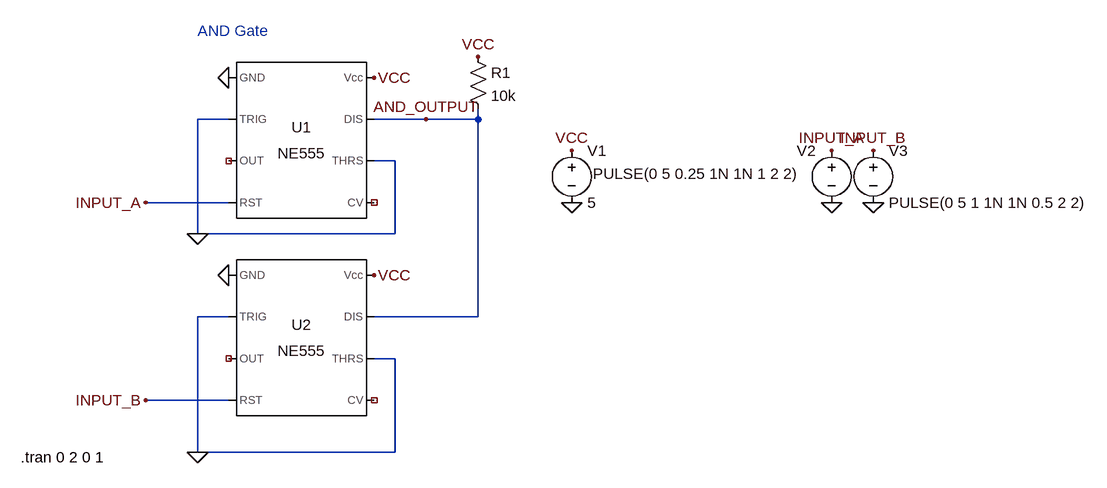
[diagram p0: schematic 555_AND_Gate.asc]
555_AND_Gate.asc, the LTspice schematic file:
Version 4
SHEET 1 1352 680
WIRE 32 48 -16 48
WIRE 336 48 256 48
WIRE 416 48 416 32
WIRE 416 48 336 48
WIRE 288 112 256 112
WIRE 32 176 -96 176
WIRE -16 224 -16 48
WIRE 288 224 288 112
WIRE 288 224 -16 224
WIRE 32 352 -16 352
WIRE 416 352 416 48
WIRE 416 352 256 352
WIRE 288 416 256 416
WIRE 32 480 -96 480
WIRE -16 560 -16 352
WIRE 288 560 288 416
WIRE 288 560 -16 560
FLAG 560 176 0
FLAG 560 96 VCC
FLAG 32 -16 0
FLAG 256 -16 VCC
FLAG 32 288 0
FLAG 256 288 VCC
FLAG -96 176 INPUT_A
FLAG -96 480 INPUT_B
FLAG 416 -48 VCC
FLAG 336 48 AND_OUTPUT
FLAG 960 176 0
FLAG 960 96 INPUT_A
FLAG 1024 176 0
FLAG 1024 96 INPUT_B
FLAG -16 224 0
FLAG -16 560 0
SYMBOL voltage 560 80 R0
SYMATTR InstName V1
SYMATTR Value 5
SYMBOL Misc\\NE555 144 80 R0
SYMATTR InstName U1
SYMBOL Misc\\NE555 144 384 R0
SYMATTR InstName U2
SYMBOL res 400 -64 R0
SYMATTR InstName R1
SYMATTR Value 10k
SYMBOL voltage 960 80 M0
WINDOW 3 49 52 Left 2
WINDOW 123 0 0 Left 0
WINDOW 39 0 0 Left 0
SYMATTR Value PULSE(0 5 0.25 1N 1N 1 2 2)
SYMATTR InstName V2
SYMBOL voltage 1024 80 R0
WINDOW 123 0 0 Left 0
WINDOW 39 0 0 Left 0
SYMATTR InstName V3
SYMATTR Value PULSE(0 5 1 1N 1N 0.5 2 2)
TEXT -16 -88 Left 2 ;AND Gate
TEXT -288 568 Left 2 !.tran 0 2 0 1

The netlist it stands for:
* 555_AND_Gate.asc
V1 VCC 0 5
XU1 0 0 NC_01 INPUT_A NC_02 0 AND_OUTPUT VCC NE555  ; pins GND TRIG OUT RST CV THRS DIS Vcc
XU2 0 0 NC_03 INPUT_B NC_04 0 AND_OUTPUT VCC NE555  ; pins GND TRIG OUT RST CV THRS DIS Vcc
R1 VCC AND_OUTPUT 10k
V2 INPUT_A 0 PULSE(0 5 0.25 1N 1N 1 2 2)
V3 INPUT_B 0 PULSE(0 5 1 1N 1N 0.5 2 2)
* AND Gate
.tran 0 2 0 1
.lib NE555.sub
.backanno
.end

* Results of the author's LTspice run, read from the files saved beside the schematic
* Operating Point, zero values left out:
*   V(vcc) = 5 V
*   V(and_output) = 1.5 mV
*   I(R1) = 499.9 µA
*   I(V3) = 400 µA
*   I(V2) = 400 µA
*   I(V1) = -4.477 mA
*   Ix(u1:1) = -1.838 mA
*   Ix(u1:4) = -400 µA
*   Ix(u1:7) = 249.9 µA
*   Ix(u1:8) = 1.988 mA
*   Ix(u2:1) = -1.838 mA
*   Ix(u2:4) = -400 µA
*   Ix(u2:7) = 249.9 µA
*   Ix(u2:8) = 1.988 mA
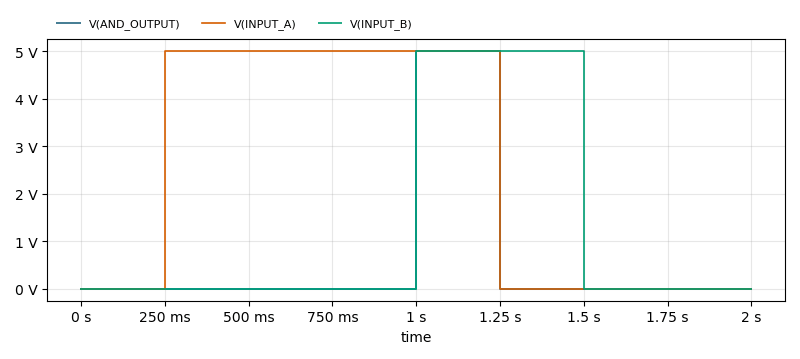
[diagram p1: Transient Analysis of 555_AND_Gate.asc, plotted from the saved traces]
* Transient Analysis, 1 run:
*   V(AND_OUTPUT): min 1.5 mV, max 5 V, average 627 mV, rms 1.768 V, last 1.5 mV
*   V(INPUT_A): min 0 V, max 5 V, average 2.5 V, rms 3.536 V, last 0 V
*   V(INPUT_B): min 0 V, max 5 V, average 1.25 V, rms 2.5 V, last 0 V